# EAGLE design Schematic (EAGLE 9.6.1)
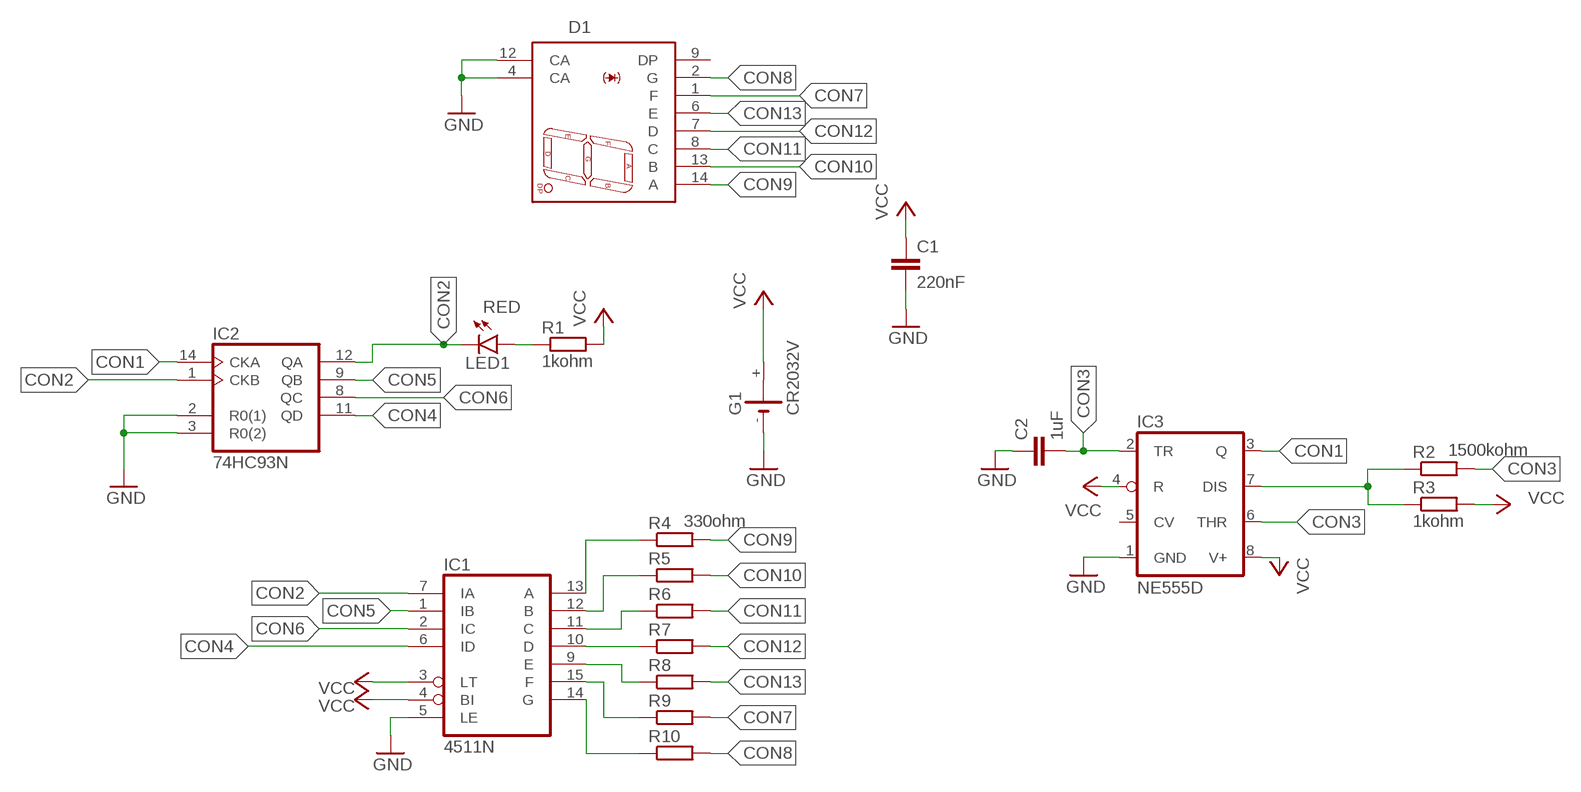
[diagram p0: schematic, sheet 1]

## Parts
C1  220nF  C-EU025-025X050  [C025-025X050]
C2  1uF  C-EU025-025X050  [C025-025X050]
D1  SA03  [S*03]
G1  CR2032V  [CR2032V]
IC1  4511N  [DIL16]
IC2  74HC93N  [DIL14]
IC3  NE555D  [SO08]
LED1  RED  LED3MM  [LED3MM]
R1  1kohm  R-EU_0204/7  [0204/7]
R2  1500kohm  R-EU_0204/7  [0204/7]
R3  1kohm  R-EU_0204/7  [0204/7]
R4  330ohm  R-EU_0204/7  [0204/7]
R5  R-EU_0204/7  [0204/7]
R6  R-EU_0204/7  [0204/7]
R7  R-EU_0204/7  [0204/7]
R8  R-EU_0204/7  [0204/7]
R9  R-EU_0204/7  [0204/7]
R10  R-EU_0204/7  [0204/7]

## Nets
CON1: IC2.14(CKA) IC3.3(Q)
CON2: IC1.7(IA) IC2.1(CKB) IC2.12(QA) LED1.K(C)
CON3: C2.2 IC3.2(TR) IC3.6(THR) R2.2
CON4: IC1.6(ID) IC2.11(QD)
CON5: IC1.1(IB) IC2.9(QB)
CON6: IC1.2(IC) IC2.8(QC)
CON7: D1.1(F) R9.2
CON8: D1.2(G) R10.2
CON9: D1.14(A) R4.2
CON10: D1.13(B) R5.2
CON11: D1.8(C) R6.2
CON12: D1.7(D) R7.2
CON13: D1.6(E) R8.2
GND: C1.2 C2.1 D1.4(CA) D1.12(CA) G1.- IC1.5(LE) IC2.2(R0(1)) IC2.3(R0(2)) IC3.1(GND)
N$1: LED1.A R1.1
N$2: IC3.7(DIS) R2.1 R3.1
N$3: IC1.13(A) R4.1
N$4: IC1.12(B) R5.1
N$5: IC1.11(C) R6.1
N$6: IC1.10(D) R7.1
N$7: IC1.9(E) R8.1
N$8: IC1.15(F) R9.1
N$9: IC1.14(G) R10.1
VCC: C1.1 G1.+ IC1.3(LT) IC1.4(BI) IC3.4(R) IC3.8(V+) R1.2 R3.2
Unconnected: D1.9(DP) G1.+@1(+) IC3.5(CV)

## Power pins joined to a net without a drawn wire
GND: IC2.10(GND)
VCC: IC2.5(VCC)
VDD: IC1.16(VDD)
VSS: IC1.8(VSS)

## Library data of the parts
C1 C2 = rcl:C-EU: CAPACITOR, European symbol; SPICEPREFIX: C
D1 = 7seg:SA03: Kingbright 0.3in row pitch Single 7 seg Display CA Source: SA03
G1 = battery:CR2032V: LI BATTERY Varta
IC1 = 45xx:4511: BCD to 7-segment LATCH/DECODER/DRIVER
IC2 = 74xx-eu:74*93: Decade, divide by twelve and binary COUNTER
IC3 = linear4:*555: TIMER
LED1 = led:LED: LED OSRAM: - CHIPLED LG R971, LG N971, LY N971, LG Q971, LY Q971, LO R971, LY R971 LH N974, LH R974 LS Q976, LO Q976, LY Q976 LO Q996 - Hyper CHIPLED LW Q18S LB Q993, LB Q99A, LB R99A - SideLED LS A670, LO A670, LY A670, LG A670, LP A670 LB A673, LV A673, LT A673, LW A673 LH A674 LY A675 LS A676, LA A676, LO A676, LY A676, LW A676 LS A679, LY A679, LG A679 - Hyper Micro SIDELED® LS Y876, LA Y876, LO Y876, LY Y876 LT Y87S - SmartLED LW L88C, LW L88S LB L89C, LB L89S, LG L890 LS L89K, LO L89K, LY L89K LS L896, LA L896, LO L896, LY L896 - TOPLED LS T670, LO T670, LY T670, LG T670, LP T670 LSG T670, LSP T670, LSY T670, LOP T670, LYG T670 LG T671, LOG T671, LSG T671 LB T673, LV T673, LT T673, LW T673 LH T674 LS T676, LA T676, LO T676, LY T676, LB T676, LH T676, LSB T676, LW T676 LB T67C, LV T67C, LT T67C, LS T67K, LO T67K, LY T67K, LW E67C LS E67B, LA E67B, LO E67B, LY E67B, LB E67C, LV E67C, LT E67C LW T67C LS T679, LY T679, LG T679 LS T770, LO T770, LY T770, LG T770, LP T770 LB T773, LV T773, LT T773, LW T773 LH T774 LS E675, LA E675, LY E675, LS T675 LS T776, LA T776, LO T776, LY T776, LB T776 LHGB T686 LT T68C, LB T68C - Hyper Mini TOPLED® LB M676 - Mini TOPLED Santana® LG M470 LS M47K, LO M47K, LY M47K Source: http://www.osram.convergy.de LUXEON: - LUMILED® LXK2-PW12-R00, LXK2-PW12-S00, LXK2-PW14-U00, LXK2-PW14-V00 LXK2-PM12-R00, LXK2-PM12-S00, LXK2-PM14-U00 LXK2-PE12-Q00, LXK2-PE12-R00, LXK2-PE12-S00, LXK2-PE14-T00, LXK2-PE14-U00 LXK2-PB12-K00, LXK2-PB12-L00, LXK2-PB12-M00, LXK2-PB14-N00, LXK2-PB14-P00, LXK2-PB14-Q00 LXK2-PR12-L00, LXK2-PR12-M00, LXK2-PR14-Q00, LXK2-PR14-R00 LXK2-PD12-Q00, LXK2-PD12-R00, LXK2-PD12-S00 LXK2-PH12-R00, LXK2-PH12-S00 LXK2-PL12-P00, LXK2-PL12-Q00, LXK2-PL12-R00 Source: www.luxeon.com KINGBRIGHT: KA-3528ASYC Source: www.kingbright.com
R1-R10 = rcl:R-EU_: RESISTOR, European symbol; SPICEPREFIX: R

## Board
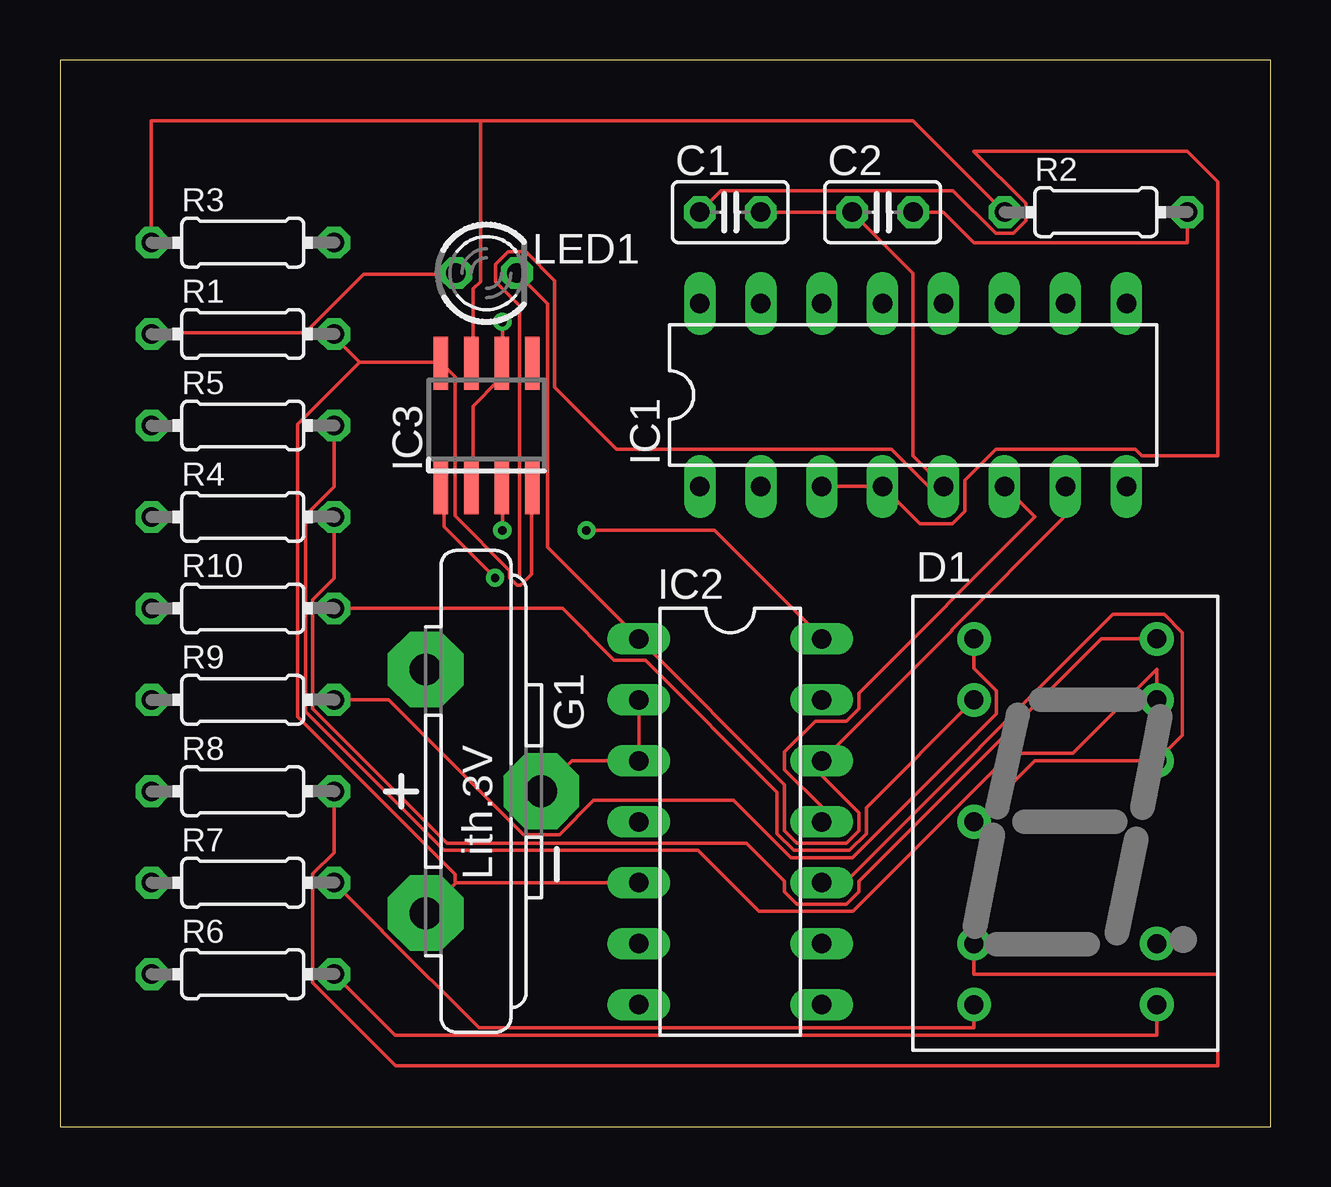
[diagram p1: board, top side]
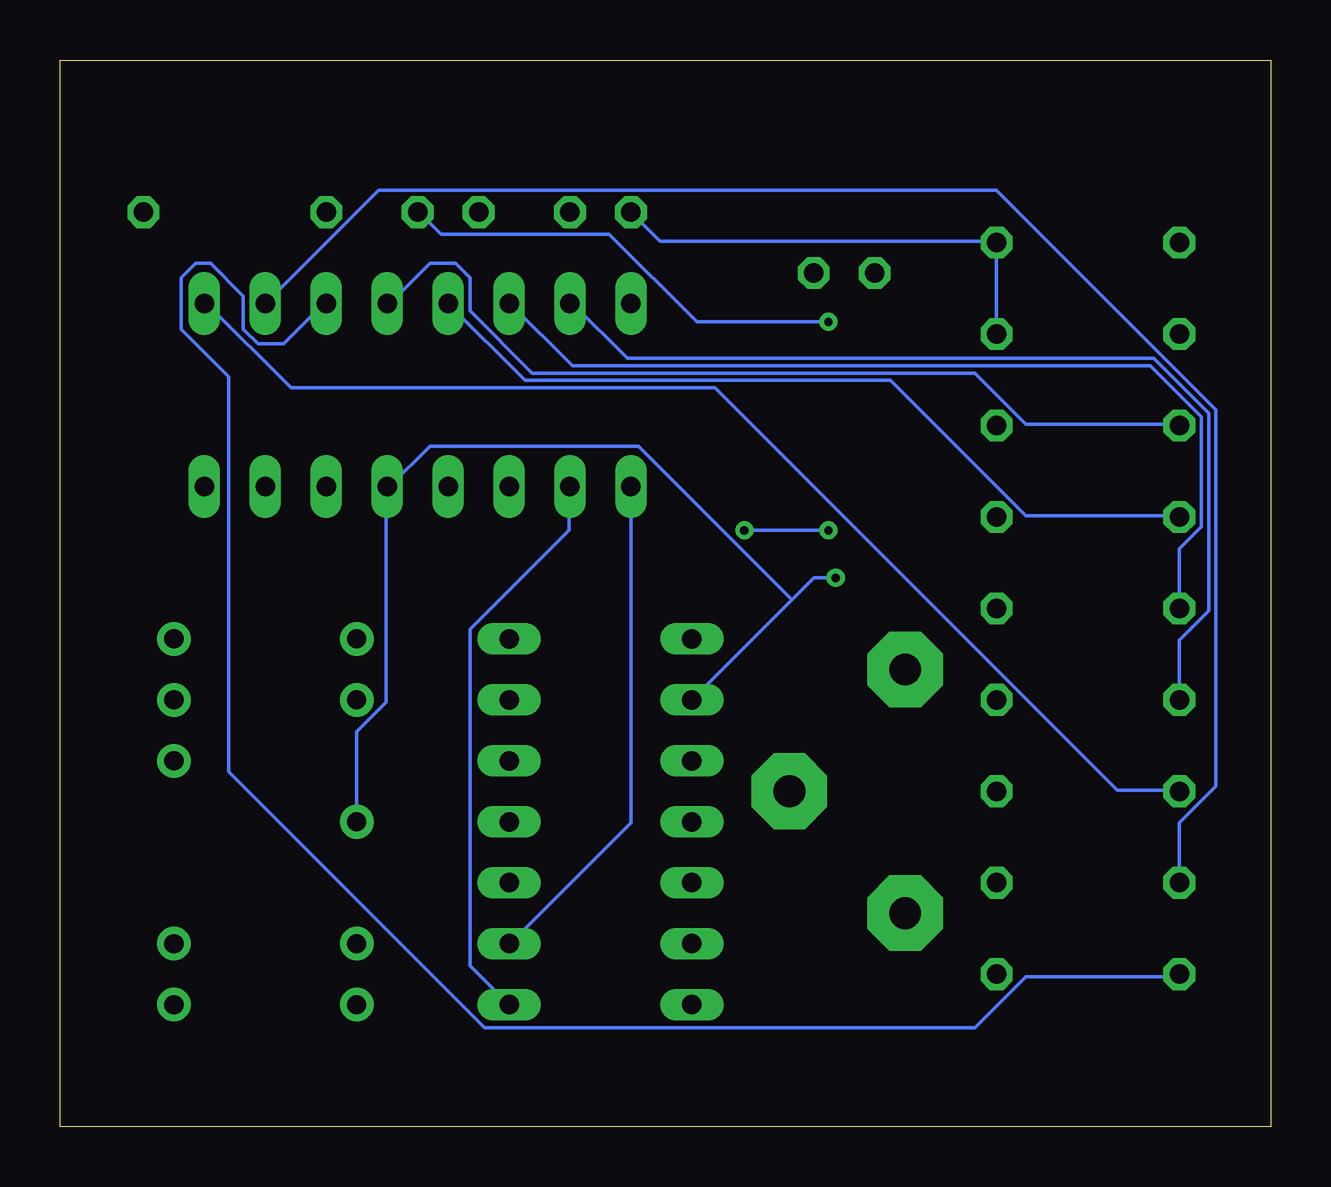
[diagram p2: board, bottom side, seen from below]

Size 50.47 x 44.44 mm. Coordinates in mm from the lower left corner, seen from the top.
Outline: 0,0 50.47,0 50.47,44.44 0,44.44 0,0
Copper layers (1*16): Top 0.035mm / dielectric 1.5mm / Bottom 0.035mm
Design rules "default": minimum track width 6mil, minimum drill 0.35mm, track to track 6mil, track to pad 6mil, pad to pad 6mil, via to via 6mil, smd to smd 6mil, copper to edge 40mil, drill to drill 6mil, minimum pad ring 10mil, minimum via ring 8mil, stop-mask expansion 4mil, vias tented up to drill 0mil, thermal gap 10mil

### Footprints (pad centres in the part's own frame; a part is rotated, then mirrored left to right if it is on the bottom)
C025-025X050 = drill 0.813 octagon: 1 -1.27,0; 2 1.27,0
S*03 = drill 0.8 pad 1.4: 1 -3.81,7.62; 2 -3.81,5.08; 4 -3.81,0; 6 -3.81,-5.08; 7 -3.81,-7.62; 8 3.81,-7.62; 9 3.81,-5.08; 12 3.81,2.54; 13 3.81,5.08; 14 3.81,7.62
CR2032V = drill 1.321 pad 3.15 octagon: + -2.54,-5.08; +@1 -2.54,5.08; - 2.286,0
DIL16 = drill 0.813 long: 1 -8.89,-3.81; 2 -6.35,-3.81; 3 -3.81,-3.81; 4 -1.27,-3.81; 5 1.27,-3.81; 6 3.81,-3.81; 7 6.35,-3.81; 8 8.89,-3.81; 9 8.89,3.81; 10 6.35,3.81; 11 3.81,3.81; 12 1.27,3.81; 13 -1.27,3.81; 14 -3.81,3.81; 15 -6.35,3.81; 16 -8.89,3.81
DIL14 = drill 0.813 long: 1 -7.62,-3.81; 2 -5.08,-3.81; 3 -2.54,-3.81; 4 0,-3.81; 5 2.54,-3.81; 6 5.08,-3.81; 7 7.62,-3.81; 8 7.62,3.81; 9 5.08,3.81; 10 2.54,3.81; 11 0,3.81; 12 -2.54,3.81; 13 -5.08,3.81; 14 -7.62,3.81
SO08 = smd 0.6 x 2.2: 1 -1.905,-2.6; 2 -0.635,-2.6; 3 0.635,-2.6; 4 1.905,-2.6; 5 1.905,2.6; 6 0.635,2.6; 7 -0.635,2.6; 8 -1.905,2.6
LED3MM = drill 0.813 octagon: A -1.27,0; K 1.27,0
0204/7 = drill 0.813 octagon: 1 -3.81,0; 2 3.81,0

### Placement (x,y rotation side)
C1  27.94,38.1 0 top
C2  34.29,38.1 0 top
D1  41.91,12.7 0 top
G1  17.78,13.97 0 top
IC1  35.56,30.48 0 top
IC2  27.94,12.7 270 top
IC3  17.78,29.21 0 top
LED1  17.78,35.56 0 top
R1  7.62,33.02 0 top
R2  43.18,38.1 0 top
R3  7.62,36.83 0 top
R4  7.62,25.4 0 top
R5  7.62,29.21 0 top
R6  7.62,6.35 0 top
R7  7.62,10.16 0 top
R8  7.62,13.97 0 top
R9  7.62,17.78 0 top
R10  7.62,21.59 0 top

### Tracks (layer width: path | path; a pad name or v marks a point on that pad's centre or on a via)
CON1  (via drill 0.35)
  Top 0.152: v18.44,24.84 18.44,26.52 IC3.3 | v21.95,24.84 27.28,24.84 31.7,20.42 IC2.14
  Bottom 0.152: v21.95,24.84 v18.44,24.84
CON2
  Top 0.152: IC1.7 41.91,25.44 37.17,20.7 37.17,20.66 IC2.12 31.75,14.62 33.3,13.07 33.3,12.33 32.78,11.81 30.72,11.81 30.2,12.33 30.2,14.25 IC2.1 20.32,24.13 20.32,34.29 LED1.K
CON3  (via drill 0.35)
  Top 0.152: C2.2 36.83,38.1 38.1,36.83 46.99,36.83 R2.2 | IC3.2 17.22,26.67 17.22,30.02 18.29,31.09 18.29,31.7 IC3.6 18.44,31.85 v18.44,33.53
  Bottom 0.152: v18.44,33.53 23.93,33.53 27.58,37.19 34.59,37.19 35.51,38.1 C2.2
CON4
  Top 0.152: IC2.11 31.75,13.32 30.2,14.87 30.2,15.61 31.48,16.89 32.78,16.89 33.3,17.41 33.3,18.06 40.64,25.4 IC1.6
CON5
  Bottom 0.152: IC1.1 26.67,12.65 31.7,7.62 IC2.9
CON6
  Bottom 0.152: IC2.8 33.38,6.71 33.38,20.73 29.26,24.84 29.26,26.67 IC1.2
CON7
  Top 0.152: D1.1 38.1,19.09 39.03,18.16 39.03,17.2 33.03,11.2 30.47,11.2 28.08,13.59 22.23,13.59 20.81,12.17 19.32,12.17 13.71,17.78 R9.2
CON8
  Top 0.152: R10.2 20.94,21.59 23.1,19.43 24.4,19.43 29.9,13.93 29.9,12.21 30.59,11.51 32.91,11.51 33.6,12.21 33.6,13.28 D1.2
CON9
  Top 0.152: D1.14 43.4,20.32 33.3,10.22 33.3,9.79 32.78,9.27 30.72,9.27 30.2,9.79 30.2,10.22 28.61,11.81 16.14,11.81 10.54,17.41 10.54,21.96 11.43,22.85 R4.2
CON10
  Top 0.152: R5.2 11.43,26.66 10.24,25.46 10.24,17.29 16.02,11.51 26.59,11.51 29.13,8.97 33.05,8.97 39.63,15.54 42.22,15.54 45.72,19.05 D1.13
CON11
  Top 0.152: R6.2 13.97,3.81 45.72,3.81 D1.8
CON12
  Top 0.152: R7.2 13.44,8.15 13.44,8.14 17.46,4.12 38.1,4.12 D1.7
CON13
  Top 0.152: R8.2 11.43,11.42 10.54,10.53 10.54,5.98 13.98,2.54 48.26,2.54 48.26,6.35 38.1,6.35 D1.6
GND  (via drill 0.35)
  Top 0.152: G1.- 21.34,15.24 IC2.3 IC2.2 | C1.2 C2.1 35.56,35.56 35.56,27.94 IC1.5 36.21,26.67 34.66,28.22 23.2,28.22 20.62,30.8 20.62,35.24 19.42,36.45 18.68,36.45 18.16,35.93 18.16,35.19 19.16,34.2 19.16,22.95 | D1.4 40.64,15.24 D1.12 46.79,16.31 46.79,20.57 46.02,21.34 43.89,21.34 32.77,10.21 31.85,10.21 IC2.10 | v18.14,22.86 16,24.99 16,26.52 IC3.1
  Bottom 0.152: v18.14,22.86 19.05,22.86 19.96,21.95 | IC2.2 19.96,21.95 | 19.96,21.95 26.36,28.35 35.05,28.35 36.73,26.67 IC1.5 36.88,26.67 36.88,17.68 38.1,16.46 D1.4
N$1
  Top 0.152: R1.1 3.81,33.07 10.21,33.07 12.65,35.51 16.46,35.51 LED1.A
N$2
  Top 0.152: R3.1 3.81,41.91 17.53,41.91 | R2.1 35.56,41.91 17.53,41.91 | 17.53,41.91 17.53,35.2 17.22,34.9 17.22,31.85 IC3.7
N$3
  Bottom 0.152: IC1.13 31.09,31.09 15.85,31.09 10.21,25.45 3.81,25.45 R4.1
N$4
  Bottom 0.152: R5.1 3.81,29.26 10.21,29.26 12.34,31.39 30.79,31.39 33.38,33.98 33.38,35.36 33.98,35.97 35.05,35.97 36.73,34.29 IC1.12
N$5
  Bottom 0.152: R6.1 3.81,6.25 10.21,6.25 12.34,4.12 32.77,4.12 43.43,14.78 43.43,31.24 45.41,33.22 45.41,35.36 44.81,35.97 44.2,35.97 42.82,34.59 42.82,33.22 42.22,32.61 41.15,32.61 39.47,34.29 IC1.11
N$6
  Bottom 0.152: R7.1 3.81,12.65 2.29,14.17 2.29,29.87 11.43,39.01 37.19,39.01 IC1.10
N$7
  Bottom 0.152: R8.1 3.81,14.02 6.4,14.02 23.16,30.79 40.84,30.79 44.35,34.29 IC1.9
N$8
  Bottom 0.152: R9.1 3.81,20.27 2.59,21.49 2.59,29.72 4.88,32 26.82,32 29.11,34.29 IC1.15
N$9
  Bottom 0.152: R10.1 3.81,24.08 2.9,24.99 2.9,29.57 5.03,31.7 29.11,31.7 31.7,34.29 IC1.14
VCC
  Top 0.152: 19.68,27.55 IC3.4 19.66,26.52 19.66,23.01 19.2,22.55 19.05,22.55 18.75,22.86 18.75,23.16 16.46,25.45 16.46,31.24 16,31.7 IC3.8 15.85,31.85 12.5,31.85 | G1.+ 16.51,10.16 | 16.51,10.16 IC2.5 | IC1.3 IC1.4 35.84,25.12 37.2,25.12 37.72,25.64 37.72,26.94 39,28.22 44.82,28.22 45.1,27.94 48.26,27.94 48.26,39.37 46.99,40.64 38.1,40.64 38.1,40.63 40.26,38.47 40.26,37.73 39.74,37.21 39,37.21 37.22,38.99 27.56,38.99 C1.1 | 12.5,31.85 11.43,32.92 R1.2 | 12.5,31.85 9.91,29.26 9.91,17.07 16.46,10.52 16.46,10.21 16.51,10.16
  Bottom 0.152: R1.2 R3.2 11.43,36.88 25.45,36.88 C1.1